# Altium schematic sheet Sensor.SchDoc
size A4; DocumentNumber: 5; SheetNumber: 5; SheetTotal: 5
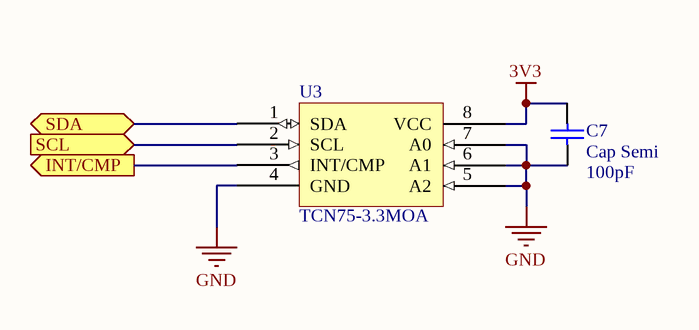
[diagram p0: Sensor.SchDoc]

## Parts
C7  Cap Semi  value 100pF  [0603_C]
U3  TCN75-3.3MOA  [SOIC-8_150mil]

## Ports
INT/CMP (out), SCL (in), SDA (bidir)

## Nets
3V3: C7.2 U3.8(VCC)
GND: C7.1 U3.4(GND) U3.5(A2) U3.6(A1) U3.7(A0)
INT/CMP: U3.3(INT/CMP) ; port INT/CMP
SCL: U3.2(SCL) ; port SCL
SDA: U3.1(SDA) ; port SDA

## Library data of the parts
C7 = Cap Semi: Capacitor (Semiconductor SIM Model); Published: 8-Jun-2000; LatestRevisionDate: 29-May-2009; LatestRevisionNote: IPC-7351 Footprint Added.; PackageReference: C1206; Publisher: Altium Limited; PackageDescription: Chip Capacitor
U3 = TCN75: TCN75数字温度传感器将-40°C到+125°C范围内的温度转换为数字